# Altium project obc-comm.PrjPCB
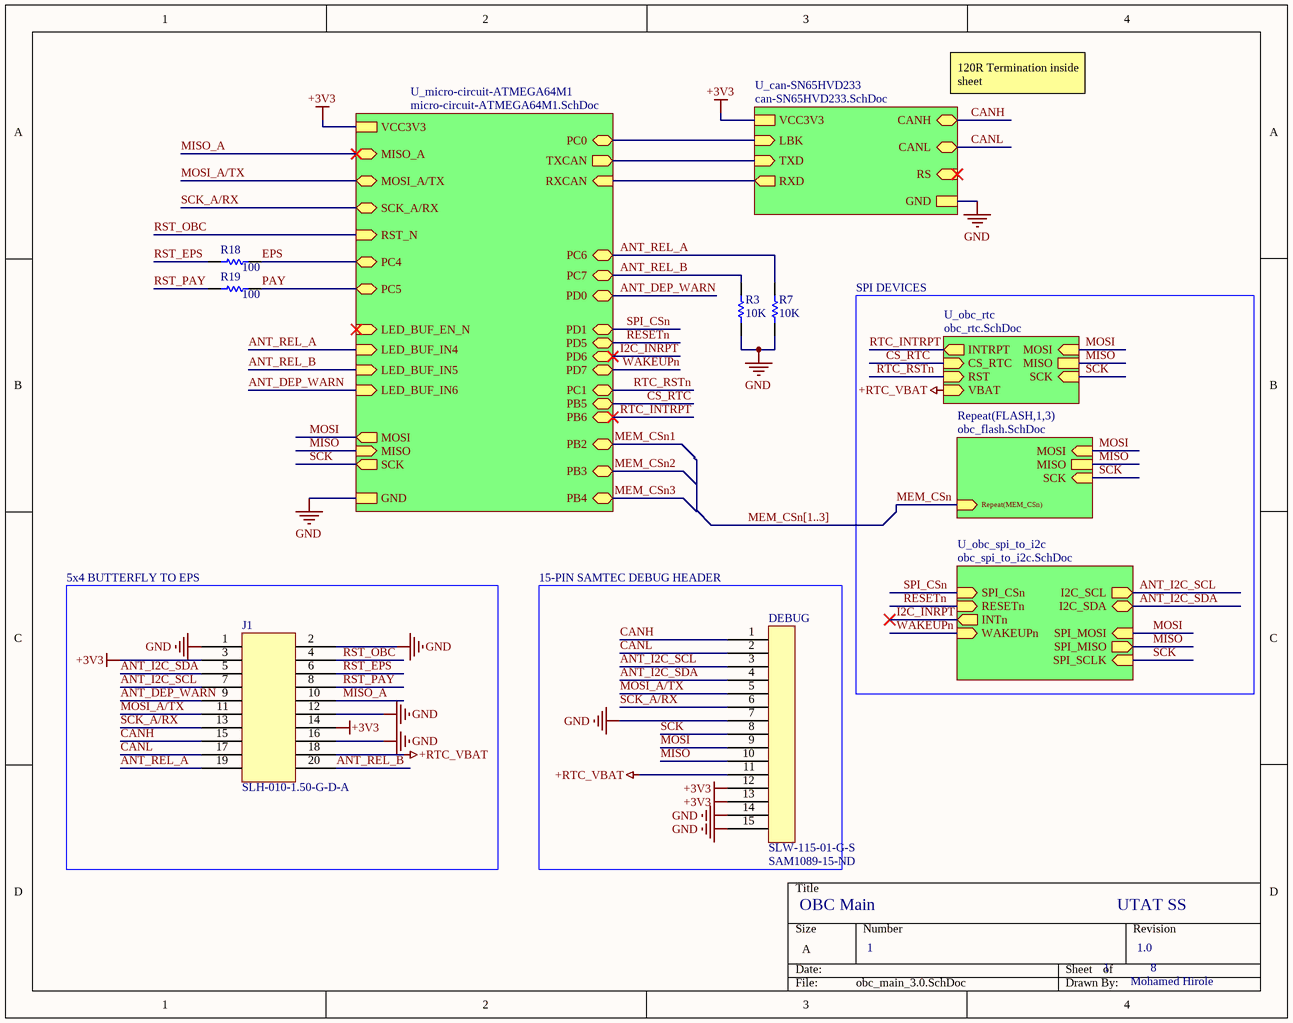
[diagram p0: obc_main_3.0.SchDoc]
4 sheets, 30 parts. Net scope: hierarchical (ports join the sheet entries above them; power ports are global).
Board file: obc-comm.PcbDoc
Sheets:
  obc_main_3.0.SchDoc
    U_obc_rtc = obc_rtc.SchDoc
    FLASH1 = obc_flash.SchDoc
    FLASH2 = obc_flash.SchDoc
    FLASH3 = obc_flash.SchDoc
    U_obc_spi_to_i2c = obc_spi_to_i2c.SchDoc

## Sheet obc_main_3.0.SchDoc: OBC Main
size A; DrawnBy: Mohamed Hirole; Organization: UTAT SS; DocumentNumber: 1; Revision: 1.0; SheetNumber: 1; SheetTotal: 8

### Parts
DEBUG  SLW-115-01-G-S  [SAM1089-15-ND]
J1  SLH-010-1.50-G-D-A  [SLH-010-1.50-G-D-A]
R3  value 10K  [RES0603R]  (hidden comment: 0603)
R7  value 10K  [RES0603R]  (hidden comment: 0603)
R18  value 100  [RES0603R]  (hidden comment: 0603)
R19  value 100  [RES0603R]  (hidden comment: 0603)

### Blocks framed on the sheet
5x4 BUTTERFLY TO EPS: J1
15-PIN SAMTEC DEBUG HEADER: DEBUG

### Sub-sheets
Repeat(FLASH,1,3) = obc_flash.SchDoc: MOSI (in), SCK (in), MISO, Repeat(MEM_CSn) (in)
U_can-SN65HVD233 = can-SN65HVD233.SchDoc (file not in this document): RXD (out), TXD (in), LBK (in), CANL (bidir), CANH (bidir), VCC3V3, GND, RS (in)
U_micro-circuit-ATMEGA64M1 = micro-circuit-ATMEGA64M1.SchDoc (file not in this document): MISO (in), MOSI (out), SCK (out), TXCAN (out), RXCAN (in), MISO_A (bidir), MOSI_A/TX (bidir), SCK_A/RX (bidir), PB2 (bidir), PB3 (bidir), PB4 (bidir), PB5 (bidir), PB6 (bidir), PC0 (bidir), PD0 (bidir), PC1 (bidir), PC4 (bidir), PC5 (bidir), PC6 (bidir), PC7 (bidir), PD1 (bidir), PD5 (bidir), PD6 (bidir), PD7 (bidir), RST_N (in), LED_BUF_EN_N (in), VCC3V3, GND, LED_BUF_IN4 (in), LED_BUF_IN5 (in), LED_BUF_IN6 (in)
U_obc_rtc = obc_rtc.SchDoc: CS_RTC (in), MOSI (in), MISO, SCK (in), INTRPT (out), VBAT (in), RST (in)
U_obc_spi_to_i2c = obc_spi_to_i2c.SchDoc: SPI_MOSI (in), I2C_SDA (bidir), INTn (out), WAKEUPn (in), RESETn (in), SPI_MISO (out), SPI_CSn (in), SPI_SCLK (in), I2C_SCL (out)

### Nets
+3V3: DEBUG.12 DEBUG.13 J1.3 J1.14 ; sheet U_micro-circuit-ATMEGA64M1/VCC3V3, sheet U_can-SN65HVD233/VCC3V3
+RTC_VBAT: DEBUG.11 J1.18 ; sheet U_obc_rtc/VBAT
GND: DEBUG.7 DEBUG.14 DEBUG.15 J1.1 J1.2 J1.12 J1.16 R3.1 R7.1 ; sheet U_micro-circuit-ATMEGA64M1/GND, sheet U_can-SN65HVD233/GND
ANT_DEP_WARN: J1.9 ; sheet U_micro-circuit-ATMEGA64M1/PD0, sheet U_micro-circuit-ATMEGA64M1/LED_BUF_IN6
ANT_I2C_SCL: DEBUG.3 J1.7 ; sheet U_obc_spi_to_i2c/I2C_SCL
ANT_I2C_SDA: DEBUG.4 J1.5 ; sheet U_obc_spi_to_i2c/I2C_SDA
ANT_REL_A: J1.19 R7.2 ; sheet U_micro-circuit-ATMEGA64M1/PC6, sheet U_micro-circuit-ATMEGA64M1/LED_BUF_IN4
ANT_REL_B: J1.20 R3.2 ; sheet U_micro-circuit-ATMEGA64M1/PC7, sheet U_micro-circuit-ATMEGA64M1/LED_BUF_IN5
CANH: DEBUG.1 J1.15 ; sheet U_can-SN65HVD233/CANH
CANL: DEBUG.2 J1.17 ; sheet U_can-SN65HVD233/CANL
CS_RTC: sheet U_obc_rtc/CS_RTC, sheet U_micro-circuit-ATMEGA64M1/PB5
EPS: R18.2 ; sheet U_micro-circuit-ATMEGA64M1/PC4
I2C_INRPT: sheet U_micro-circuit-ATMEGA64M1/PD6, sheet U_obc_spi_to_i2c/INTn
MEM_CSn: sheet Repeat(FLASH,1,3)/Repeat(MEM_CSn)
MISO: DEBUG.10 ; sheet U_obc_rtc/MISO, sheet Repeat(FLASH,1,3)/MISO, sheet U_micro-circuit-ATMEGA64M1/MISO, sheet U_obc_spi_to_i2c/SPI_MISO
MISO_A: J1.10 ; sheet U_micro-circuit-ATMEGA64M1/MISO_A
MOSI: DEBUG.9 ; sheet U_obc_rtc/MOSI, sheet Repeat(FLASH,1,3)/MOSI, sheet U_micro-circuit-ATMEGA64M1/MOSI, sheet U_obc_spi_to_i2c/SPI_MOSI
MOSI_A/TX: DEBUG.5 J1.11 ; sheet U_micro-circuit-ATMEGA64M1/MOSI_A/TX
PAY: R19.2 ; sheet U_micro-circuit-ATMEGA64M1/PC5
RESETn: sheet U_micro-circuit-ATMEGA64M1/PD5, sheet U_obc_spi_to_i2c/RESETn
RST_EPS: J1.6 R18.1
RST_OBC: J1.4 ; sheet U_micro-circuit-ATMEGA64M1/RST_N
RST_PAY: J1.8 R19.1
RTC_INTRPT: sheet U_obc_rtc/INTRPT, sheet U_micro-circuit-ATMEGA64M1/PB6
RTC_RSTn: sheet U_obc_rtc/RST, sheet U_micro-circuit-ATMEGA64M1/PC1
SCK: DEBUG.8 ; sheet U_obc_rtc/SCK, sheet Repeat(FLASH,1,3)/SCK, sheet U_micro-circuit-ATMEGA64M1/SCK, sheet U_obc_spi_to_i2c/SPI_SCLK
SCK_A/RX: DEBUG.6 J1.13 ; sheet U_micro-circuit-ATMEGA64M1/SCK_A/RX
SPI_CSn: sheet U_micro-circuit-ATMEGA64M1/PD1, sheet U_obc_spi_to_i2c/SPI_CSn
WAKEUPn: sheet U_micro-circuit-ATMEGA64M1/PD7, sheet U_obc_spi_to_i2c/WAKEUPn
(unnamed): sheet U_micro-circuit-ATMEGA64M1/TXCAN, sheet U_can-SN65HVD233/TXD
(unnamed): sheet U_micro-circuit-ATMEGA64M1/RXCAN, sheet U_can-SN65HVD233/RXD
(unnamed): sheet U_micro-circuit-ATMEGA64M1/PC0, sheet U_can-SN65HVD233/LBK

### Buses and harness runs
bus MEM_CSn[1..3]

### Notes on the sheet
- 120R Termination inside sheet
- SPI DEVICES

### Library data of the parts
DEBUG = SLW-115-01-G-S: 15 Position Receptacle Connector 0.100" (2.54mm) Through Hole Gold; Manufacturer: Samtec; Max Current Rating: 7.1A; Contact Resistance: 10mR; Number of Positions: 15; Max Voltage Rating (AC): 550V; Gender: Female; Supplier 1: Digi-Key; Manufacturer Part Number: SLW-115-01-G-S; Stock 1: 0; Pricing 1: 1=2.44, 10=2.214, 25=2.0784, 50=1.988, 100=1.8976, 250=1.71684, 500=1.5813 (USD); Mount: Through Hole; Contact Plating: Gold; Contact Material: Bronze; Color: Black; Housing Color: Black; Housing Material: Polyester; Min Operating Temperature: -55°C; Max Operating Temperature: 125°C; Number of Rows: 1; Packaging: Bulk; Connector Type: Receptacle; Termination: Solder; Number of Contacts: 15; Orientation: Straight; Voltage Rating (AC): 550V; Package Quantity: 1; Length: 38.1mm; Pitch: 2.54mm; Depth: 2.54mm; Width: 2.54mm; Radiation Hardening: No; Lead Free: Lead Free; ComponentLink1URL: http://suddendocs.samtec.com/prints/slw-1xx-01-x-x-mkt.pdf?src-supplier=Digi-Key; ComponentLink1Description: http://suddendocs.samtec.com/prints/slw-1xx-01-x-x-mkt.pdf?src-supplier=Digi-Key; Supplier Part Number 1: SAM1089-15-ND
J1 = SLH-010-1.50-G-D-A: 0.50 mm Razor Beam™ LP Ultra Low Profile Socket Strip, alignment pin option; Supplier 1: SLH-010-1.50-G-D-A; Supplier Part Number 1: Samtec; ComponentLink1Description: Product Page; ComponentLink1URL: https://www.samtec.com/products/slh-010-1.50-g-d-a
R3 R7 R18 R19 = RES0603: 0603 resistor

## Sheet obc_rtc.SchDoc: Real Time Clock
size A4; DrawnBy: Mohamed Hirole; Organization: UTAT SS; DocumentNumber: 3; Revision: 2.0; SheetNumber: 3; SheetTotal: 8
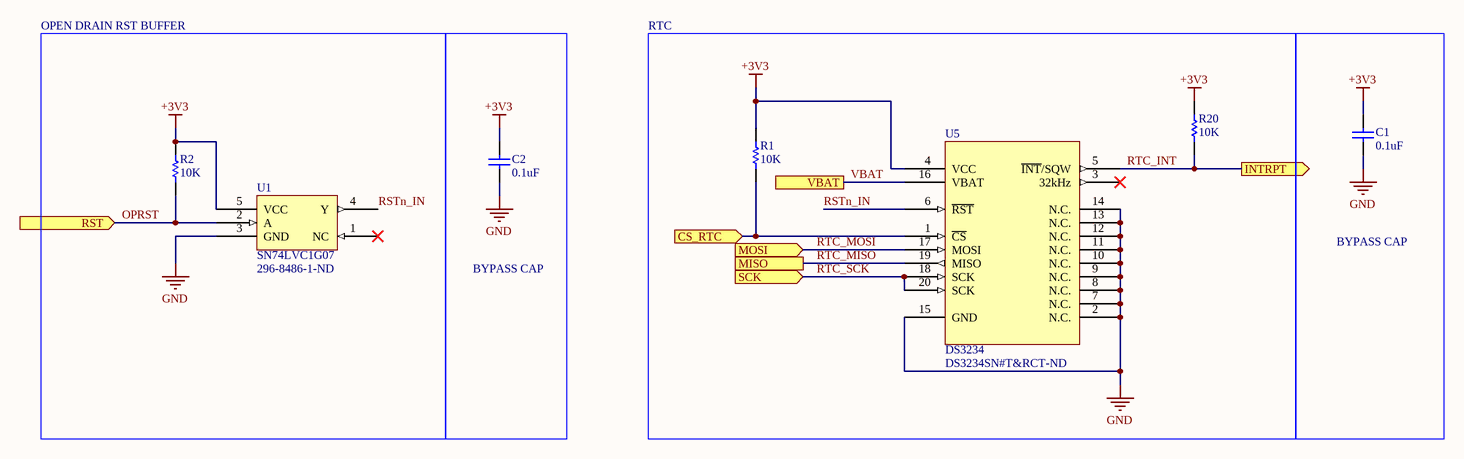
[diagram p1: obc_rtc.SchDoc]

### Parts
C1  value 0.1uF  [CAP0603R]  (hidden comment: 0603)
C2  value 0.1uF  [CAP0603R]  (hidden comment: 0603)
R1  value 10K  [RES0603R]  (hidden comment: 0603)
R2  value 10K  [RES0603R]  (hidden comment: 0603)
R20  value 10K  [RES0603R]  (hidden comment: 0603)
U1  SN74LVC1G07  Supplier Part Number 1: 296-8486-1-ND  [SOT65P210X110-5N]
U5  DS3234  Supplier Part Number 2: DS3234SN#T&RCT-ND  [SOIC127P1032X265-20]

### Blocks framed on the sheet
OPEN DRAIN RST BUFFER: R2 U1
BYPASS CAP: C2
RTC: R1 R20 U5
BYPASS CAP: C1

### Ports
CS_RTC (in), INTRPT (out), MISO, MOSI (in), RST (in), SCK (in), VBAT

### Nets
+3V3: C1.2 C2.2 R1.2 R2.2 R20.2 U1.5(VCC) U5.4(VCC)
GND: C1.1 C2.1 U1.3(GND) U5.2(N.C.) U5.7(N.C.) U5.8(N.C.) U5.9(N.C.) U5.10(N.C.) U5.11(N.C.) U5.12(N.C.) U5.13(N.C.) U5.14(N.C.) U5.15(GND)
VBAT: U5.16(VBAT) ; port VBAT  [project net +RTC_VBAT]
CS_RTC: R1.1 U5.1(~{CS}) ; port CS_RTC
OPRST: R2.1 U1.2(A) ; port RST  [project net RTC_RSTn]
RSTn_IN: U1.4(Y) U5.6(~{RST})
RTC_INT: R20.1 U5.5(~{INT}/SQW) ; port INTRPT  [project net RTC_INTRPT]
RTC_MISO: U5.19(MISO) ; port MISO  [project net MISO]
RTC_MOSI: U5.17(MOSI) ; port MOSI  [project net MOSI]
RTC_SCK: U5.18(SCK) U5.20(SCK) ; port SCK  [project net SCK]

Not connected (* = marked no-connect by the designer): U1 1(NC)*; U5 3(32kHz)*

### Library data of the parts
C1 C2 = CAP0603: 0603 capacitor
R1 R2 R20 = RES0603: 0603 resistor
U1 = SN74LVC1G07: Single element non-inverting open drain buffer; Supplier 1: Digi-Key
U5 = DS3234: SPI bus RTC with integrated crystal and SRAM; Supplier 1: Digi-Key; Supplier 2: Digi-Key

## Sheet obc_flash.SchDoc: Flash Memory
size A4; DrawnBy: Mohamed Hirole; Organization: UTAT SS; DocumentNumber: 2; Revision: 2.0; SheetNumber: 2; SheetTotal: 8
Used 3 times, as channels FLASH1, FLASH2, FLASH3. Parts and nets are listed once, with the designators drawn on the sheet.
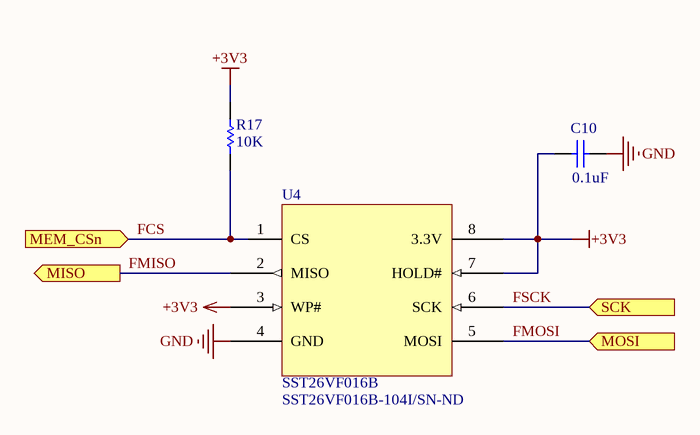
[diagram p2: obc_flash.SchDoc]

### Parts
C10  value 0.1uF  [CAP0603R]  (hidden comment: 0603)
R17  value 10K  [RES0603R]  (hidden comment: 0603)
U4  SST26VF016B  Supplier Part Number 1: SST26VF016B-104I/SN-ND  [SOIC127P500X600-8N]

### Ports
MEM_CSn (in), MISO (out), MOSI (in), SCK (in)

### Nets
+3V3: C10.1 R17.2 U4.3(WP#) U4.7(HOLD#) U4.8(3.3V)
GND: C10.2 U4.4(GND)
FCS: R17.1 U4.1(CS) ; port MEM_CSn
FMISO: U4.2(MISO) ; port MISO
FMOSI: U4.5(MOSI) ; port MOSI
FSCK: U4.6(SCK) ; port SCK

### Channels
FLASH1: designators end in _FLASH1; ports MEM_CSn=MEM_CSn1 MISO=MISO MOSI=MOSI SCK=SCK
FLASH2: designators end in _FLASH2; ports MEM_CSn=MEM_CSn2 MISO=MISO MOSI=MOSI SCK=SCK
FLASH3: designators end in _FLASH3; ports MEM_CSn=MEM_CSn3 MISO=MISO MOSI=MOSI SCK=SCK

### Library data of the parts
C10 = CAP0603: 0603 capacitor
R17 = RES0603: 0603 resistor
U4 = SST26VF016B: 2.5V/3.0V 16 Mbit Serial Quad I/O (SQI) Flash Memory; ComponentLink1Description: SST25VF016B; ComponentLink1URL: https://www.digikey.ca/product-detail/en/microchip-technology/SST26VF016B-104I-SN/SST26VF016B-104I-SN-ND/5033651; Supplier 1: Digi-Key

## Sheet obc_spi_to_i2c.SchDoc: SPI to I2C Bridge
size A4; DrawnBy: Mohamed Hirole; Organization: UTAT SS; DocumentNumber: 4; Revision: 1.0; SheetNumber: 4; SheetTotal: 8
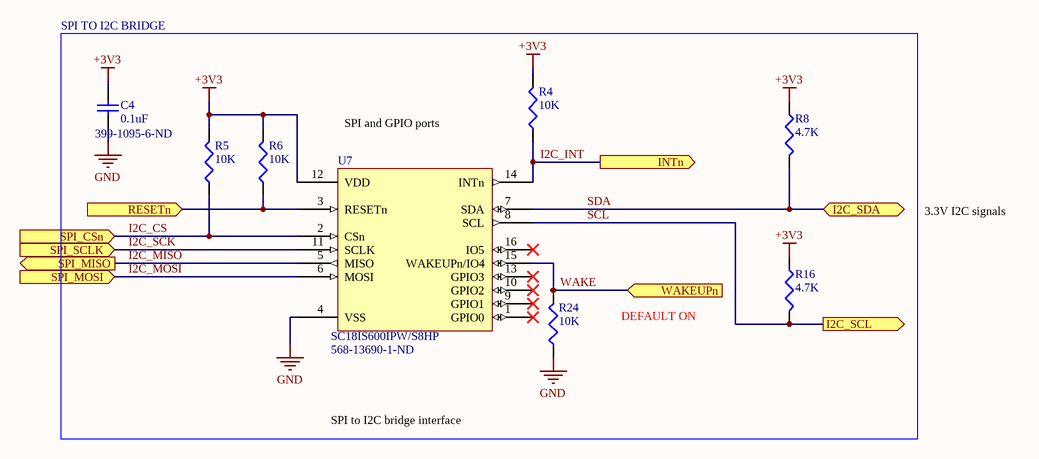
[diagram p3: obc_spi_to_i2c.SchDoc]

### Parts
C4  0.1uF  Supplier Part Number 1: 399-1095-6-ND  [1608[0603]]
R4  10K  [J1-0603]
R5  10K  [J1-0603]
R6  10K  [J1-0603]
R8  4.7K  [J1-0603]
R16  4.7K  [J1-0603]
R24  10K  [J1-0603]
U7  SC18IS600IPW/S8HP  Supplier Part Number 1: 568-13690-1-ND  [TSOP65P640X110-16N]

### Ports
I2C_SCL (out), I2C_SDA (bidir), INTn (out), RESETn (in), SPI_CSn (in), SPI_MISO (out), SPI_MOSI (in), SPI_SCLK (in), WAKEUPn (in)

### Nets
+3V3: C4.2 R4.2 R5.2 R6.2 R8.1 R16.1 U7.12(VDD)
GND: C4.1 R24.1 U7.4(VSS)
I2C_CS: R5.1 U7.2(CSn) ; port SPI_CSn  [project net SPI_CSn]
I2C_INT: R4.1 U7.14(INTn) ; port INTn  [project net I2C_INRPT]
I2C_MISO: U7.5(MISO) ; port SPI_MISO  [project net MISO]
I2C_MOSI: U7.6(MOSI) ; port SPI_MOSI  [project net MOSI]
I2C_SCK: U7.11(SCLK) ; port SPI_SCLK  [project net SCK]
RESETn: R6.1 U7.3(RESETn) ; port RESETn
SCL: R16.2 U7.8(SCL) ; port I2C_SCL  [project net ANT_I2C_SCL]
SDA: R8.2 U7.7(SDA) ; port I2C_SDA  [project net ANT_I2C_SDA]
WAKE: R24.2 U7.15(WAKEUPn/IO4) ; port WAKEUPn  [project net WAKEUPn]

Not connected (* = marked no-connect by the designer): U7 1(GPIO0)* 9(GPIO1)* 10(GPIO2)* 13(GPIO3)* 16(IO5)*

### Notes on the sheet
- SPI TO I2C BRIDGE
- SPI and GPIO ports
- 3.3V I2C signals
- DEFAULT ON
- SPI to I2C bridge interface

### Library data of the parts
C4 = Cap: Capacitor; Published: 8-Jun-2000; LatestRevisionDate: 17-Jul-2002; LatestRevisionNote: Re-released for DXP Platform.; PackageReference: RAD-0.3; Publisher: Altium Limited; PackageDescription: Radial Cap, Thru-Hole; 2 Leads; 0.3 in Pin Spacing; Value: 0.1uF; Supplier 1: Digi-Key
R4-R6 R8 R16 R24 = Res3: Resistor; Published: 8-Jun-2000; LatestRevisionDate: 29-May-2009; LatestRevisionNote: IPC-7351 Footprint Added.; PackageReference: J1-0603; Publisher: Altium Limited; PackageDescription: Chip Resistor
  R4-R6 R24: Value: 10K; Supplier 1: Digi-Key; Supplier Part Number 1: P10.0KHDKR-ND
  R8 R16: Value: 4.7K
U7 = SC18IS600IPW/S8HP: SPI to I2C bridge.; Supplier 1: Digikey

## Nets that join several sheets
+3V3: obc_main_3.0 (DEBUG.12 DEBUG.13 J1.3 J1.14), obc_rtc (7 pins), FLASH1 (5 pins), FLASH2 (5 pins), FLASH3 (5 pins), obc_spi_to_i2c (7 pins)
+RTC_VBAT: obc_main_3.0 (DEBUG.11 J1.18), obc_rtc (U5.16)
GND: obc_main_3.0 (9 pins), obc_rtc (13 pins), FLASH1 (C10_FLASH1.2 U4_FLASH1.4), FLASH2 (C10_FLASH2.2 U4_FLASH2.4), FLASH3 (C10_FLASH3.2 U4_FLASH3.4), obc_spi_to_i2c (C4.1 R24.1 U7.4)
ANT_I2C_SCL: obc_main_3.0 (DEBUG.3 J1.7), obc_spi_to_i2c (R16.2 U7.8)
ANT_I2C_SDA: obc_main_3.0 (DEBUG.4 J1.5), obc_spi_to_i2c (R8.2 U7.7)
MISO: obc_main_3.0 (DEBUG.10), obc_rtc (U5.19), FLASH1 (U4_FLASH1.2), FLASH2 (U4_FLASH2.2), FLASH3 (U4_FLASH3.2), obc_spi_to_i2c (U7.5)
MOSI: obc_main_3.0 (DEBUG.9), obc_rtc (U5.17), FLASH1 (U4_FLASH1.5), FLASH2 (U4_FLASH2.5), FLASH3 (U4_FLASH3.5), obc_spi_to_i2c (U7.6)
SCK: obc_main_3.0 (DEBUG.8), obc_rtc (U5.18 U5.20), FLASH1 (U4_FLASH1.6), FLASH2 (U4_FLASH2.6), FLASH3 (U4_FLASH3.6), obc_spi_to_i2c (U7.11)